# Altium schematic sheet SRAM1.SchDoc: SRAM1
size A; Revision: 04
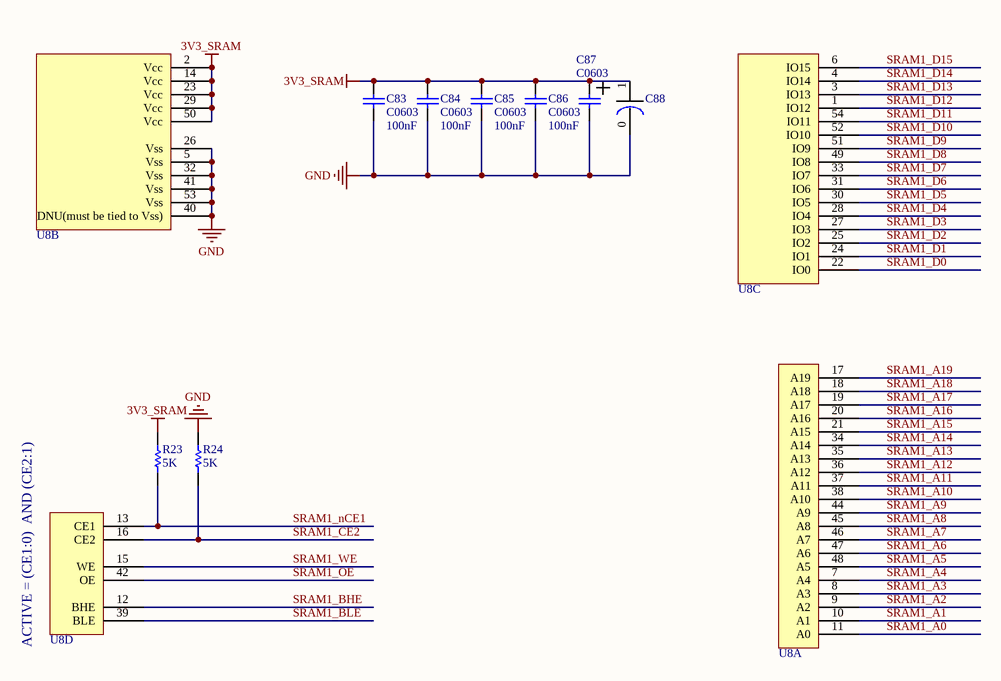
[diagram p0: SRAM1.SchDoc]

## Parts
C83  C0603  value 100nF  [0603]
C84  C0603  value 100nF  [0603]
C85  C0603  value 100nF  [0603]
C86  C0603  value 100nF  [0603]
C87  C0603  [0603]
C88  Electrolytic SMD Cap  [22_47u_10A]  (value not drawn)
R23  5K  [ERA-0805]
R24  5K  [ERA-0805]
U8  SRAM  [PCBComponent_1]  (value not drawn)  (parts A,B,C,D of 4)

## Nets
3V3_SRAM: C83.2 C84.2 C85.2 C86.2 C87.2 C88.1 R23.2 U8.2(Vcc) U8.14(Vcc) U8.23(Vcc) U8.29(Vcc) U8.50(Vcc)
GND: C83.1 C84.1 C85.1 C86.1 C87.1 C88.0 R24.2 U8.5(Vss) U8.26(Vss) U8.32(Vss) U8.40(DNU(must_be_tied_to_Vss)) U8.41(Vss) U8.53(Vss)
SRAM1_A0: U8.11(A0)
SRAM1_A1: U8.10(A1)
SRAM1_A2: U8.9(A2)
SRAM1_A3: U8.8(A3)
SRAM1_A4: U8.7(A4)
SRAM1_A5: U8.48(A5)
SRAM1_A6: U8.47(A6)
SRAM1_A7: U8.46(A7)
SRAM1_A8: U8.45(A8)
SRAM1_A9: U8.44(A9)
SRAM1_A10: U8.38(A10)
SRAM1_A11: U8.37(A11)
SRAM1_A12: U8.36(A12)
SRAM1_A13: U8.35(A13)
SRAM1_A14: U8.34(A14)
SRAM1_A15: U8.21(A15)
SRAM1_A16: U8.20(A16)
SRAM1_A17: U8.19(A17)
SRAM1_A18: U8.18(A18)
SRAM1_A19: U8.17(A19)
SRAM1_BHE: U8.12(BHE)
SRAM1_BLE: U8.39(BLE)
SRAM1_CE2: R24.1 U8.16(CE2)
SRAM1_D0: U8.22(IO0)
SRAM1_D1: U8.24(IO1)
SRAM1_D2: U8.25(IO2)
SRAM1_D3: U8.27(IO3)
SRAM1_D4: U8.28(IO4)
SRAM1_D5: U8.30(IO5)
SRAM1_D6: U8.31(IO6)
SRAM1_D7: U8.33(IO7)
SRAM1_D8: U8.49(IO8)
SRAM1_D9: U8.51(IO9)
SRAM1_D10: U8.52(IO10)
SRAM1_D11: U8.54(IO11)
SRAM1_D12: U8.1(IO12)
SRAM1_D13: U8.3(IO13)
SRAM1_D14: U8.4(IO14)
SRAM1_D15: U8.6(IO15)
SRAM1_nCE1: R23.1 U8.13(CE1)
SRAM1_OE: U8.42(OE)
SRAM1_WE: U8.15(WE)

## Notes on the sheet
- ACTIVE = (CE1:0)  AND (CE2:1)
- Engineer:
- Title:
- Saleh Jamali
- Revision:

## Library data of the parts
C83-C87 = C0603: Ceramic Chip Capacitor - Standard; Note: Footprint corresponds to dimensions for bulk cassette packaging. This case size has tightened tolerances.; Published: 17-Jul-2002; LatestRevisionDate: 19-Mar-2004; LatestRevisionNote: Silkscreen size reduced.; DatasheetDocument: Mar-2001; PackageDocument: Mar-2001; PackageReference: 0603; Publisher: Altium Limited; Code_JEITA: 0603; Code_IPC: 1608 [0603]; ComponentLink1Description: Manufacturer Link; ComponentLink1URL: http://www.kemet.com/; ComponentLink2Description: Datasheet; ComponentLink2URL: http://www.kemet.com/kemet/web/homepage/kechome.nsf/vapubfilesname/F3102TA.pdf/$file/F3102TA.pdf
R23 R24 = ERA6Y: Rectangular Thick Film Chip Resistor, 10 Ohm to 1M Ohm Range, 0.1% and 0.5% Tolerance, 0805 Size, 0.1 W; Note: If flow soldering, adjust pad width of PCB Footprint to 0.7 - 0.8 times the width of the resistor.; Published: 17-Dec-2003; LatestRevisionDate: 19-Mar-2004; LatestRevisionNote: Silkscreen size reduced.; PackageDocument: Mar-2003; PackageReference: ERA-0805; Publisher: Altium Limited; Code_IPC: 2012 [0805]; ComponentLink1Description: Manufacturer Link; ComponentLink1URL: http://www.panasonic.com/industrial/components/resistive_products.htm; ComponentLink2Description: Datasheet; ComponentLink2URL: http://www.panasonic.com/industrial/components/pdf/AOA0000CE8.pdf
U8 = CY7C1061AV33: Static RAM
C88 = Electrolytic SMD Cap: supplier: eshop.eca.ir